# Altium schematic sheet CPU_DIN_mainboard.SchDoc
size A3
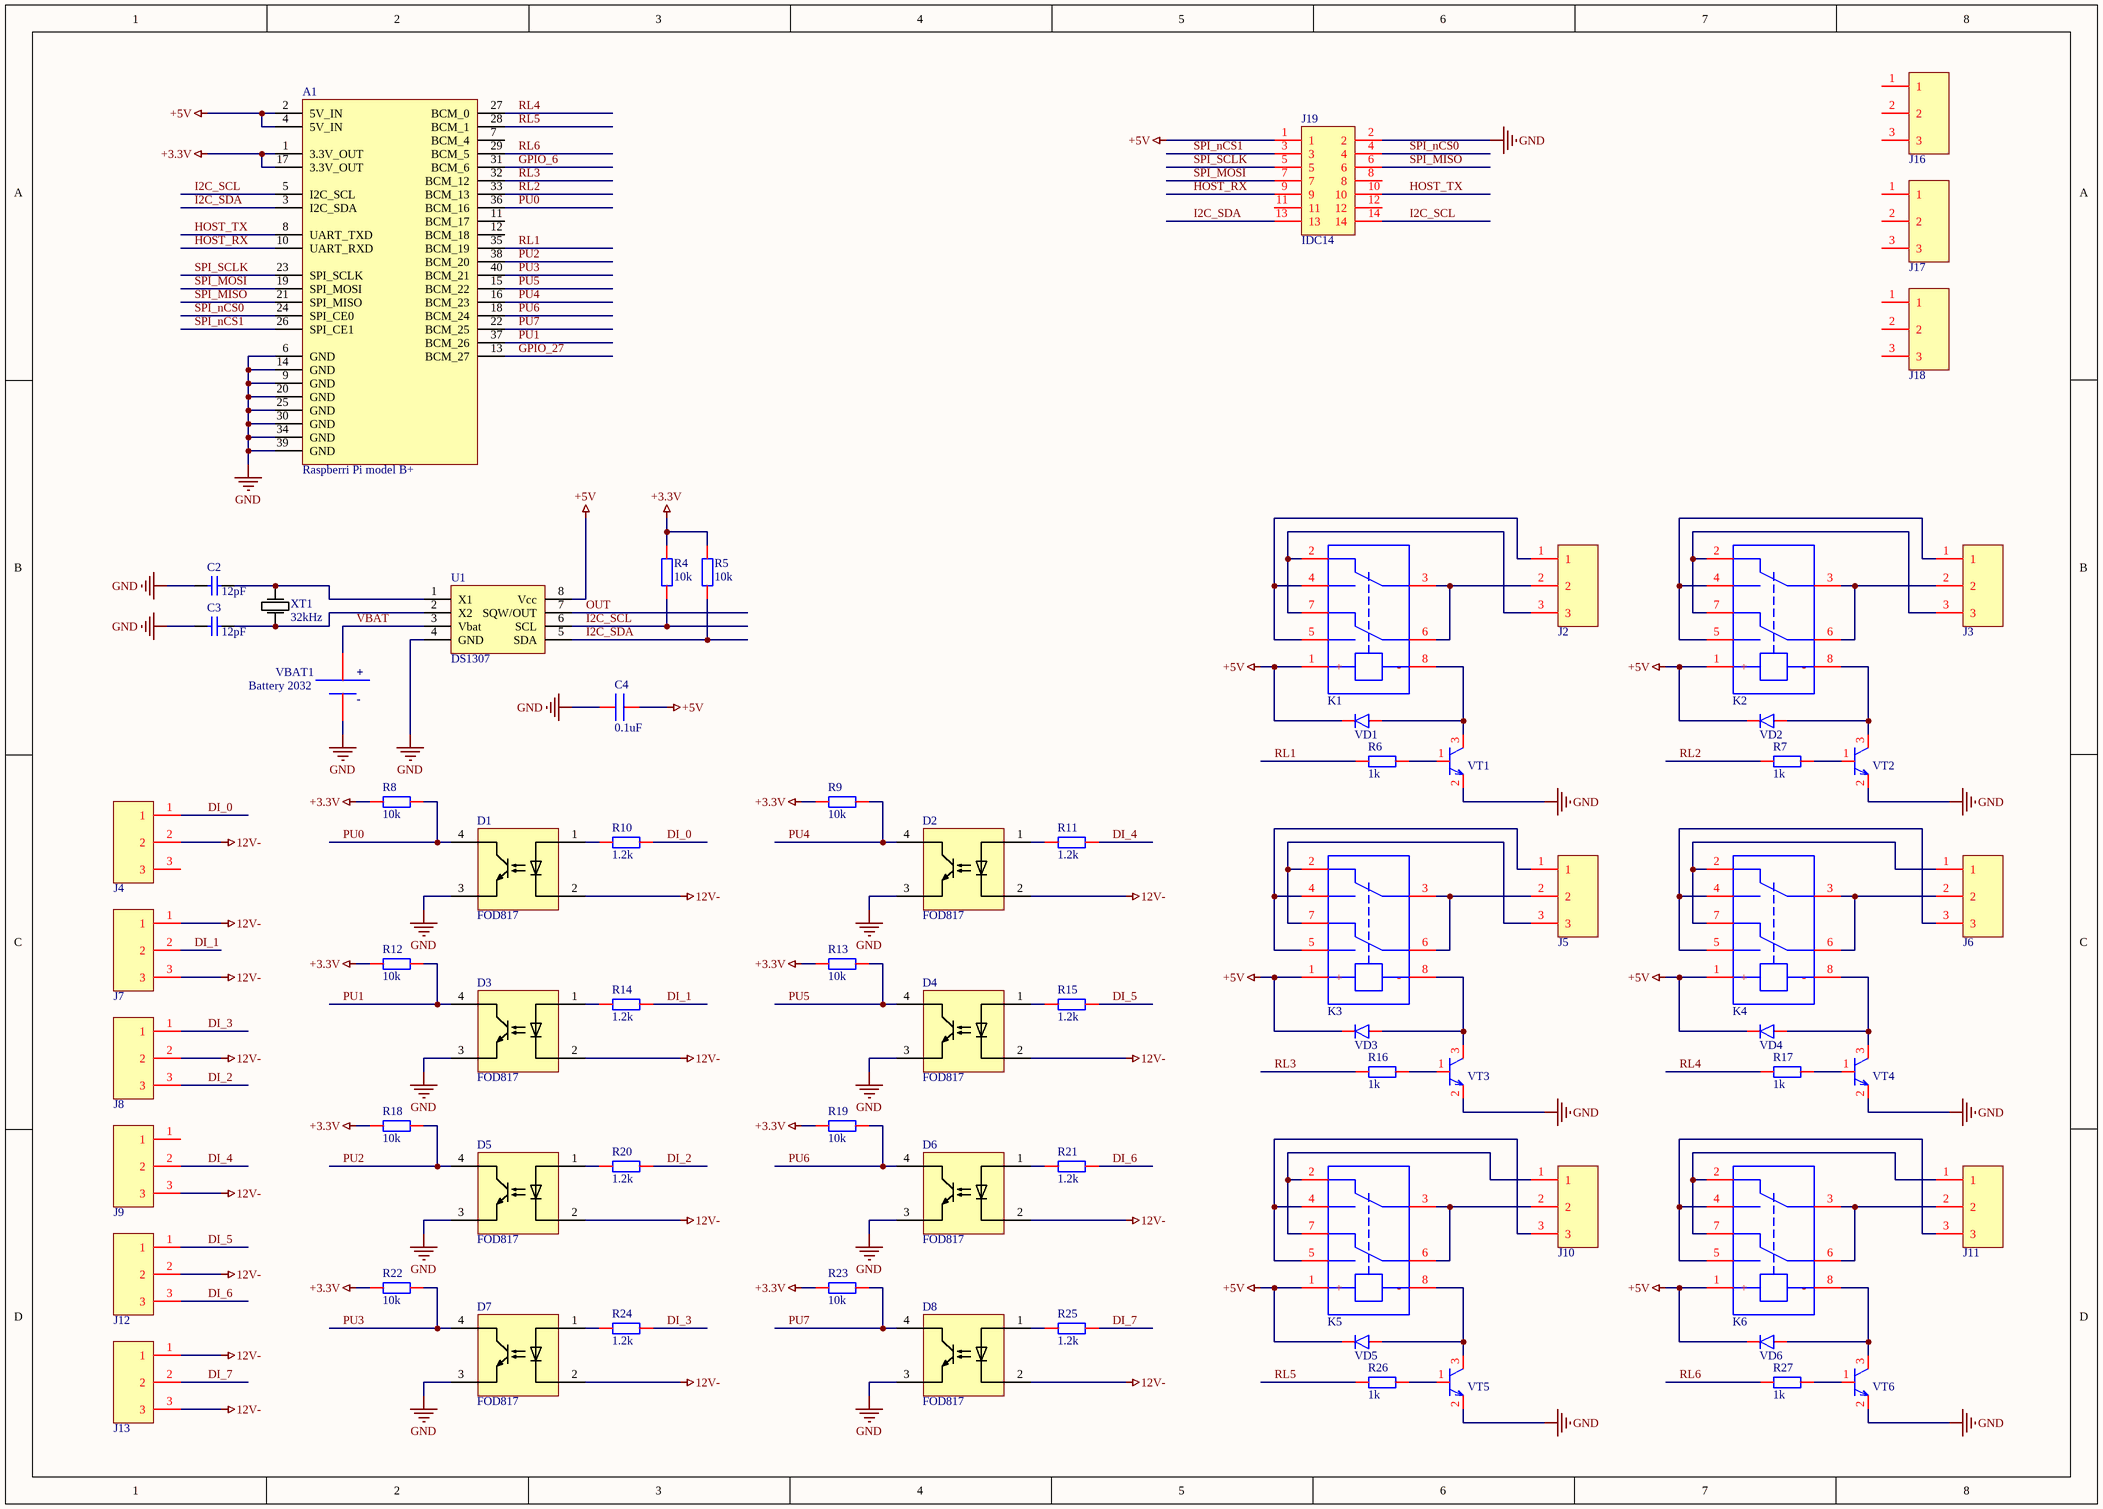
[diagram p0: CPU_DIN_mainboard.SchDoc]

## Parts
A1  Raspberri Pi model B+  [PBD-40]
C2  12pF  [C0805]
C3  12pF  [C0805]
C4  0.1uF  [C0805]
D1  FOD817  [DIP4_300mil_SMD]
D2  FOD817  [DIP4_300mil_SMD]
D3  FOD817  [DIP4_300mil_SMD]
D4  FOD817  [DIP4_300mil_SMD]
D5  FOD817  [DIP4_300mil_SMD]
D6  FOD817  [DIP4_300mil_SMD]
D7  FOD817  [DIP4_300mil_SMD]
D8  FOD817  [DIP4_300mil_SMD]
J2  Terminal block TB-3  [TB-3_ser370]  (value not drawn)
J3  Terminal block TB-3  [TB-3_ser370]  (value not drawn)
J4  Terminal block TB-3  [TB-3_ser370]  (value not drawn)
J5  Terminal block TB-3  [TB-3_ser370]  (value not drawn)
J6  Terminal block TB-3  [TB-3_ser370]  (value not drawn)
J7  Terminal block TB-3  [TB-3_ser370]  (value not drawn)
J8  Terminal block TB-3  [TB-3_ser370]  (value not drawn)
J9  Terminal block TB-3  [TB-3_ser370]  (value not drawn)
J10  Terminal block TB-3  [TB-3_ser370]  (value not drawn)
J11  Terminal block TB-3  [TB-3_ser370]  (value not drawn)
J12  Terminal block TB-3  [TB-3_ser370]  (value not drawn)
J13  Terminal block TB-3  [TB-3_ser370]  (value not drawn)
J16  Terminal block TB-3  [TB-3_ser370]  (value not drawn)
J17  Terminal block TB-3  [TB-3_ser370]  (value not drawn)
J18  Terminal block TB-3  [TB-3_ser370]  (value not drawn)
J19  IDC14  [IDC14]
K1  IM03GR  [TYCO_2C]  (value not drawn)
K2  IM03GR  [TYCO_2C]  (value not drawn)
K3  IM03GR  [TYCO_2C]  (value not drawn)
K4  IM03GR  [TYCO_2C]  (value not drawn)
K5  IM03GR  [TYCO_2C]  (value not drawn)
K6  IM03GR  [TYCO_2C]  (value not drawn)
R4  10k  [R0805]
R5  10k  [R0805]
R6  1k  [R0805]
R7  1k  [R0805]
R8  10k  [R0805]
R9  10k  [R0805]
R10  1.2k  [R0805]
R11  1.2k  [R0805]
R12  10k  [R0805]
R13  10k  [R0805]
R14  1.2k  [R0805]
R15  1.2k  [R0805]
R16  1k  [R0805]
R17  1k  [R0805]
R18  10k  [R0805]
R19  10k  [R0805]
R20  1.2k  [R0805]
R21  1.2k  [R0805]
R22  10k  [R0805]
R23  10k  [R0805]
R24  1.2k  [R0805]
R25  1.2k  [R0805]
R26  1k  [R0805]
R27  1k  [R0805]
U1  DS1307  [SO-8_LM358D]
VBAT1  Battery 2032  [Battery_CR2032]
VD1  BAV199  [SMA DIOD]  (value not drawn)
VD2  BAV199  [SMA DIOD]  (value not drawn)
VD3  BAV199  [SMA DIOD]  (value not drawn)
VD4  BAV199  [SMA DIOD]  (value not drawn)
VD5  BAV199  [SMA DIOD]  (value not drawn)
VD6  BAV199  [SMA DIOD]  (value not drawn)
VT1  BC817  [SOT23]  (value not drawn)
VT2  BC817  [SOT23]  (value not drawn)
VT3  BC817  [SOT23]  (value not drawn)
VT4  BC817  [SOT23]  (value not drawn)
VT5  BC817  [SOT23]  (value not drawn)
VT6  BC817  [SOT23]  (value not drawn)
XT1  32kHz  [XTAL_d2x6mm]

## Nets
12V-: D1.2 D2.2 D3.2 D4.2 D5.2 D6.2 D7.2 D8.2 J4.2 J7.1 J7.3 J8.2 J9.3 J12.2 J13.1 J13.3
+3.3V: A1.1(3.3V_OUT) A1.17(3.3V_OUT) R4.2 R5.2 R8.2 R9.2 R12.2 R13.2 R18.2 R19.2 R22.2 R23.2
+5V: A1.2(5V_IN) A1.4(5V_IN) C4.2 J19.1 K1.1(+) K2.1(+) K3.1(+) K4.1(+) K5.1(+) K6.1(+) U1.8(Vcc) VD1.K VD2.K VD3.K VD4.K VD5.K VD6.K
GND: A1.6(GND) A1.9(GND) A1.14(GND) A1.20(GND) A1.25(GND) A1.30(GND) A1.34(GND) A1.39(GND) C2.2 C3.2 C4.1 D1.3 D2.3 D3.3 D4.3 D5.3 D6.3 D7.3 D8.3 J19.2 U1.4(GND) VBAT1.N(-) VT1.2(E) VT2.2(E) VT3.2(E) VT4.2(E) VT5.2(E) VT6.2(E)
DI_0: J4.1 R10.1
DI_1: J7.2 R14.1
DI_2: J8.3 R20.1
DI_3: J8.1 R24.1
DI_4: J9.2 R11.1
DI_5: J12.1 R15.1
DI_6: J12.3 R21.1
DI_7: J13.2 R25.1
GPIO_6: A1.31(BCM_6)
GPIO_27: A1.13(BCM_27)
HOST_RX: A1.10(UART_RXD) J19.9
HOST_TX: A1.8(UART_TXD) J19.10
I2C_SCL: A1.5(I2C_SCL) J19.14 R4.1 U1.6(SCL)
I2C_SDA: A1.3(I2C_SDA) J19.13 R5.1 U1.5(SDA)
OUT: U1.7(SQW/OUT)
PU0: A1.36(BCM_16) D1.4 R8.1
PU1: A1.37(BCM_26) D3.4 R12.1
PU2: A1.38(BCM_20) D5.4 R18.1
PU3: A1.40(BCM_21) D7.4 R22.1
PU4: A1.16(BCM_23) D2.4 R9.1
PU5: A1.15(BCM_22) D4.4 R13.1
PU6: A1.18(BCM_24) D6.4 R19.1
PU7: A1.22(BCM_25) D8.4 R23.1
RL1: A1.35(BCM_19) R6.2
RL2: A1.33(BCM_13) R7.2
RL3: A1.32(BCM_12) R16.2
RL4: A1.27(BCM_0) R17.2
RL5: A1.28(BCM_1) R26.2
RL6: A1.29(BCM_5) R27.2
SPI_MISO: A1.21(SPI_MISO) J19.6
SPI_MOSI: A1.19(SPI_MOSI) J19.7
SPI_nCS0: A1.24(SPI_CE0) J19.4
SPI_nCS1: A1.26(SPI_CE1) J19.3
SPI_SCLK: A1.23(SPI_SCLK) J19.5
VBAT: U1.3(Vbat) VBAT1.P(+)
NetC2_1: C2.1 U1.1(X1) XT1.2
NetC3_1: C3.1 U1.2(X2) XT1.1
NetD1_1: D1.1 R10.2
NetD2_1: D2.1 R11.2
NetD3_1: D3.1 R14.2
NetD4_1: D4.1 R15.2
NetD5_1: D5.1 R20.2
NetD6_1: D6.1 R21.2
NetD7_1: D7.1 R24.2
NetD8_1: D8.1 R25.2
NetJ2_1: J2.1 K1.4 K1.5
NetJ2_2: J2.2 K1.3(1C) K1.6(2C)
NetJ2_3: J2.3 K1.2 K1.7
NetJ3_1: J3.1 K2.4 K2.5
NetJ3_2: J3.2 K2.3(1C) K2.6(2C)
NetJ3_3: J3.3 K2.2 K2.7
NetJ5_1: J5.1 K3.4 K3.5
NetJ5_2: J5.2 K3.3(1C) K3.6(2C)
NetJ5_3: J5.3 K3.2 K3.7
NetJ6_1: J6.1 K4.2 K4.7
NetJ6_2: J6.2 K4.3(1C) K4.6(2C)
NetJ6_3: J6.3 K4.4 K4.5
NetJ10_1: J10.1 K5.2 K5.7
NetJ10_2: J10.2 K5.3(1C) K5.6(2C)
NetJ10_3: J10.3 K5.4 K5.5
NetJ11_1: J11.1 K6.2 K6.7
NetJ11_2: J11.2 K6.3(1C) K6.6(2C)
NetJ11_3: J11.3 K6.4 K6.5
NetK1_8: K1.8(-) VD1.A VT1.3(C)
NetK2_8: K2.8(-) VD2.A VT2.3(C)
NetK3_8: K3.8(-) VD3.A VT3.3(C)
NetK4_8: K4.8(-) VD4.A VT4.3(C)
NetK5_8: K5.8(-) VD5.A VT5.3(C)
NetK6_8: K6.8(-) VD6.A VT6.3(C)
NetR6_1: R6.1 VT1.1(B)
NetR7_1: R7.1 VT2.1(B)
NetR16_1: R16.1 VT3.1(B)
NetR17_1: R17.1 VT4.1(B)
NetR26_1: R26.1 VT5.1(B)
NetR27_1: R27.1 VT6.1(B)

Not connected (* = marked no-connect by the designer): A1 7(BCM_4) 11(BCM_17) 12(BCM_18); J4 3; J9 1; J16 1 2 3; J17 1 2 3; J18 1 2 3; J19 8 11 12

## Library data of the parts
A1 = RPi_Bplus: partnum: PBD-40
C2-C4 = CAP_SMD
  C2 C3: value: 12pF
  C4: value: 0.1uF
D1-D8 = FOD817: partnum: FOD817ASD
J2-J13 J16-J18 = TB-3
K1-K6 = IM06GR: partnum: IM03GR
R4-R27 = RES_SMD
  R4 R5: value: 10k
  R6 R7 R16 R17 R26 R27: value: 1k
  R8 R9 R12 R13 R18 R19 R22 R23: value: 10k; partnum: 10k
  R10 R11 R14 R15 R20 R21 R24 R25: value: 1.2k; partnum: 1.2k
U1 = DS1307: partnum: DS1307Z+
VBAT1 = BATTERY_2032: pin to pad: N>3 P>1; partnum: BAT/HOLD.HU2032-LF
VD1-VD6 = DIOD: partnum: VS-15MQ040NTRPBF
VT1-VT6 = BC817: partnum: BC817-16LT1G
XT1 = XTAL: partnum: KX-26T 32.768 kHz; value: 32kHz